# Altium schematic sheet ADXL345.SchDoc
size A4; Organization: Altium Limited; Address1: L3, 12a Rodborough Rd; Address2: Frenchs Forest; Address3: NSW; Address4: Australia 2086; SheetNumber: 9; SheetTotal: 10
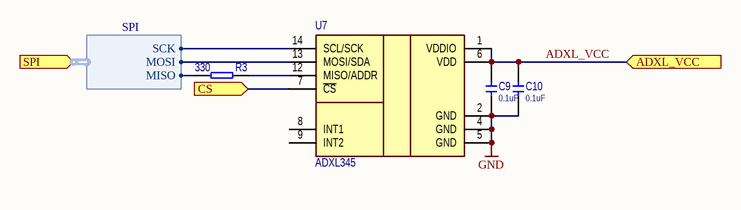
[diagram p0: ADXL345.SchDoc]

## Parts
C9  value 0.1uF  [CERCAP 0402]
C10  value 0.1uF  [CERCAP 0402]
R3  value 330  [RES 0402]
U7  ADXL345  [LGA14_ADXL345]

## Ports
ADXL_VCC (in), CS (in), SPI (in, harness SPI)

## Harnesses
SPI: SCK, MOSI, MISO

## Nets
GND: C9.1 C10.1 U7.2(GND) U7.4(GND) U7.5(GND)
ADXL_VCC: C9.2 C10.2 U7.1(VDDIO) U7.6(VDD) ; port ADXL_VCC
CS: U7.7(~{CS}) ; port CS
NetR3_1: R3.1 ; port SPI.MISO
NetR3_2: R3.2 U7.12(MISO/ADDR)
NetU7_13: U7.13(MOSI/SDA) ; port SPI.MOSI
NetU7_14: U7.14(SCL/SCK) ; port SPI.SCK

Not connected (* = marked no-connect by the designer): U7 8(INT1) 9(INT2)

## Notes on the sheet
- Title
- Size:
- Date:
- A4
- Number:
- Time:
- Revision:
- Sheet
- of
- File:

## Library data of the parts
C9 C10 = !Capacitor: Capacitor; IsSMT: NoSMT; Diel: X7R; Voltage: *
R3 = !Resistor: Resistor; IsSMT: NoSMT
U7 = ADXL345: Acc